# Altium schematic sheet Sheet1.SchDoc
size 420 x 297 mm; Author: ALTIUM GOSTBOM2.0 KEV; Перв.Примен.: Перв.Примен.; Проект: Проект; Наименование_организации: Наименование_организации; п_Разраб_Р: п_Разраб_Р; п_Пров_Р: п_Пров_Р; п_Утв_Р: п_Утв_Р
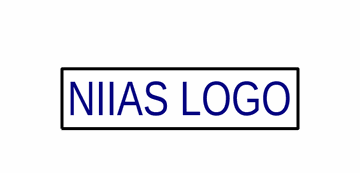
[diagram p0: Sheet1.SchDoc]

## Parts
?  LOGO_NIIAS  [LOGO NIIAS]  (value not drawn)  (no BOM)

## Notes on the sheet
- Перв. примен.
- Справ. №
- Подп. дата
- Инв. № дубл.
- Взам. инв. №
- Подп. и дата
- Изм.
- Разраб.
- Лист
- № докум.
- Подп.
- Дата
- Лит.
- Масса
- Масштаб
- Пров.
- Т.контр.
- Листов
- Инв. № подл.
- Н.контр.
- Утв.
- НИИАС
- ALTIUM GOSTBOM2.0 KEV
- Файл:
- Копировал
- Формат А3
- (in symbol LOGO_NIIAS-1) NIIAS LOGO

## Library data of the parts
? = LOGO_NIIAS-1